# EAGLE design INTERNAL_VCC (EAGLE 7.2.0)
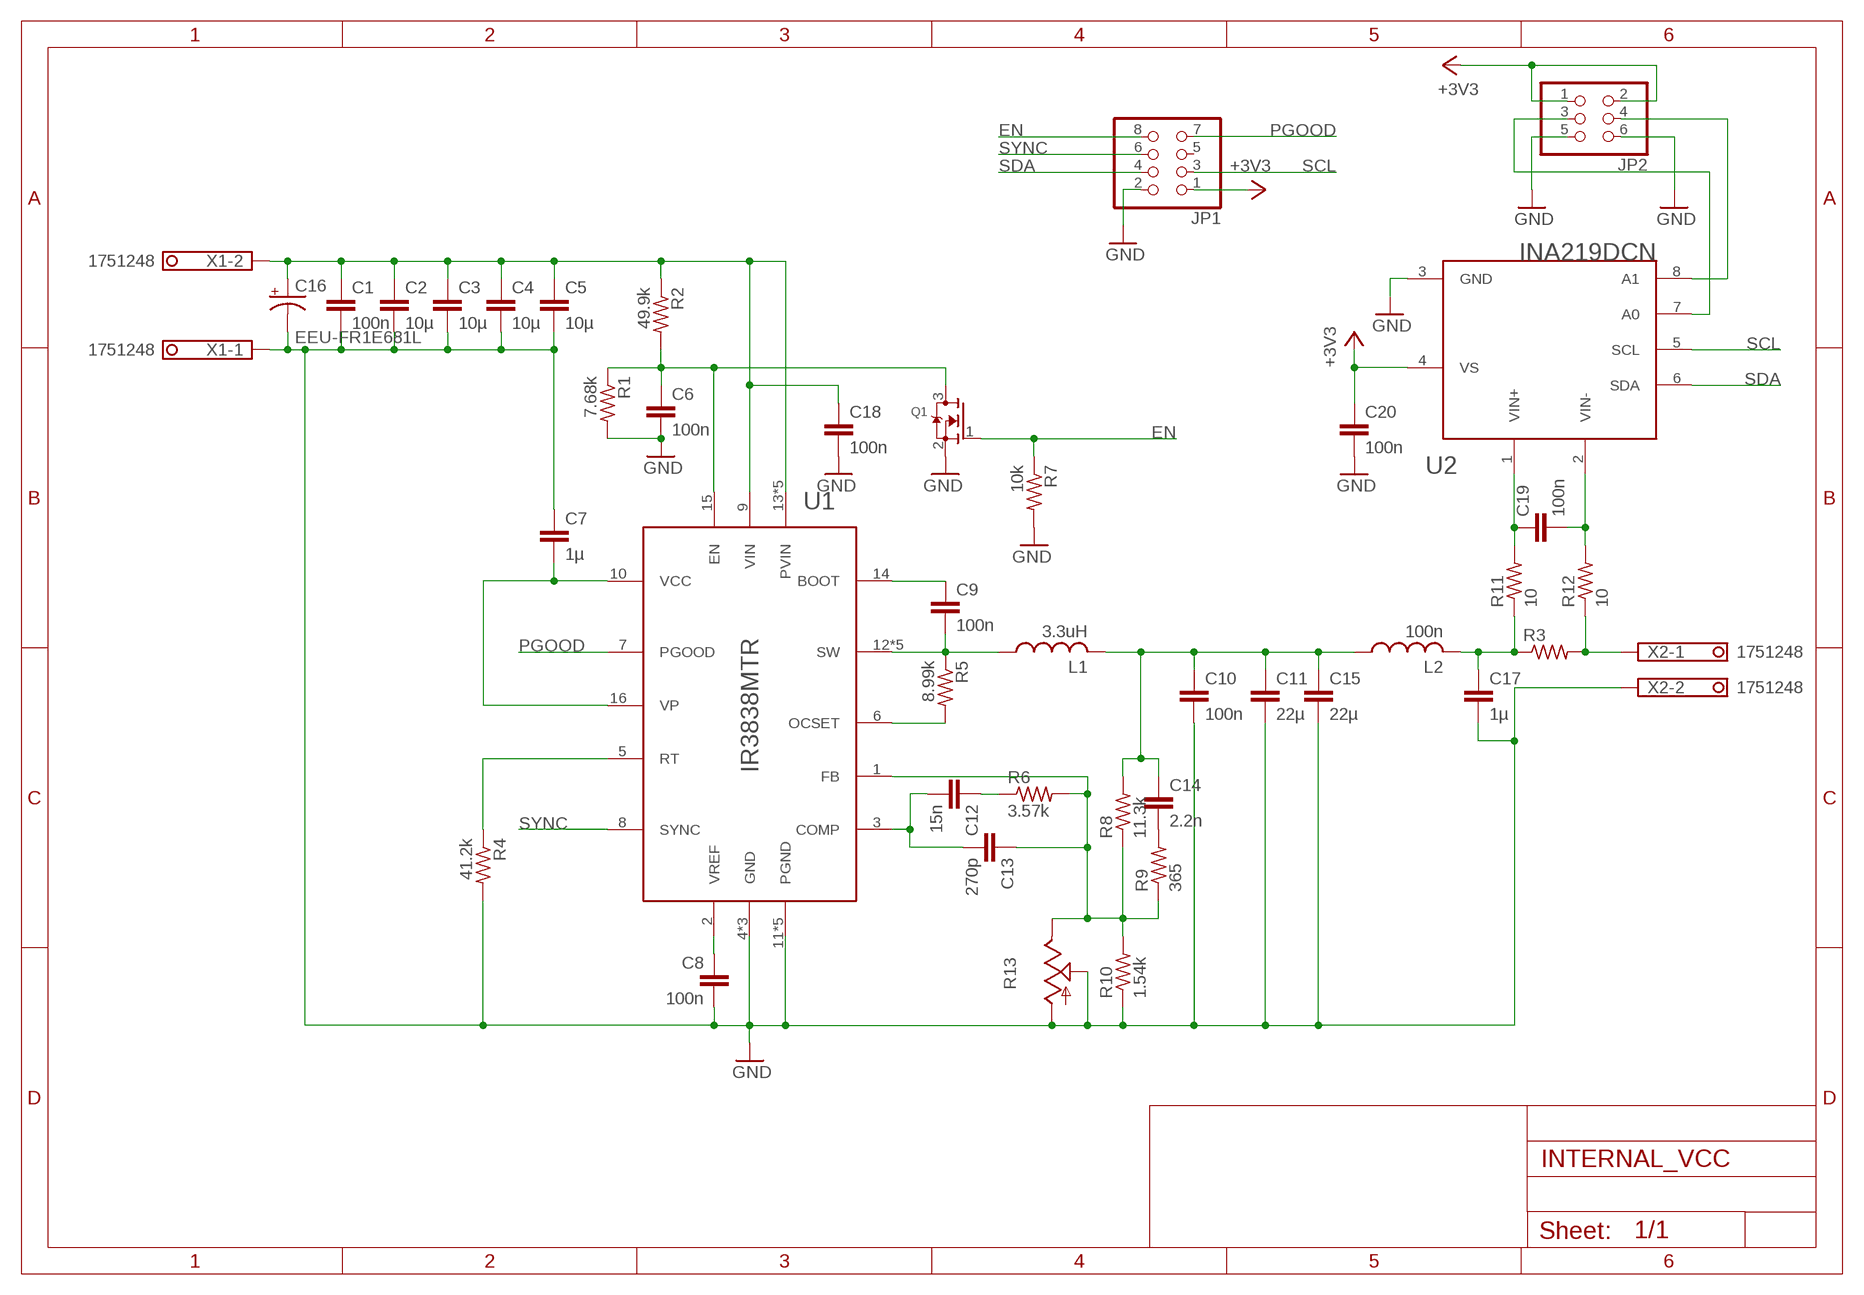
[diagram p0: schematic, sheet 1]

## Parts
C1  100n  C-EUC0603  [C0603]
C2  10µ  C-EUC1206  [C1206]
C3  10µ  C-EUC1206  [C1206]
C4  10µ  C-EUC1206  [C1206]
C5  10µ  C-EUC1206  [C1206]
C6  100n  C-EUC0603  [C0603]
C7  1µ  C-EUC0603  [C0603]
C8  100n  C-EUC0603  [C0603]
C9  100n  C-EUC0603  [C0603]
C10  100n  C-EUC0603  [C0603]
C11  22µ  C-EUC1210  [C1210]
C12  15n  C-EUC0603  [C0603]
C13  270p  C-EUC0603  [C0603]
C14  2.2n  C-EUC0603  [C0603]
C15  22µ  C-EUC1210  [C1210]
C16  EEU-FR1E681L  CPOL-USE3.5-8  [E3,5-8]
C17  1µ  C-EUC0603  [C0603]
C18  100n  C-EUC0603  [C0603]
C19  100n  C-EUC0603  [C0603]
C20  100n  C-EUC0603  [C0603]
JP1  PINHD-2X4/90  [2X04/90]
JP2  PINHD-2X3  [2X03]
L1  3.3uH  L-USXAL7070  [XAL7070]
L2  100n  L-USSRP5030CA  [SRP5030CA]
Q1  MOSFET-NREFLOW  [SOT23]
R1  7.68k  R-US_R0603  [R0603]
R2  49.9k  R-US_R0603  [R0603]
R3  R-US_R2010  [R2010]
R4  41.2k  R-US_R0603  [R0603]
R5  8.99k  R-US_R0603  [R0603]
R6  3.57k  R-US_R0603  [R0603]
R7  10k  R-US_R0603  [R0603]
R8  11.3k  R-US_R0603  [R0603]
R9  365  R-US_R0603  [R0603]
R10  1.54k  R-US_R0603  [R0603]
R11  10  R-US_R0603  [R0603]
R12  10  R-US_R0603  [R0603]
R13  TRIM_US-B25P  [B25P]
U1  IR3838MTR  [PQFN_5X6_MM]
U2  INA219DCN  [DCN-R-PDSO-G8]
X1  1751248  [1751248]
X2  1751248  [1751248]

## Nets
+3V3: C20.1 JP1.1 JP2.1 JP2.2 U2.4(VS)
EN: JP1.8 Q1.1(G) R7.1
GND: C1.2 C2.2 C3.2 C4.2 C5.2 C6.2 C7.1 C8.2 C10.2 C11.2 C15.2 C16.- C17.2 C18.2 C20.2 JP1.2 JP2.5 JP2.6 Q1.2(S) R1.2 R4.2 R7.2 R10.1 R13.A R13.S U1.4(GND) U1.11(PGND) U1.11@1(PGND) U1.11@2(PGND) U1.11@3(PGND) U1.11@4(PGND) U1.P$1(GND) U1.P$26(GND) U2.3(GND) X1.1 X2.2
N$1: C1.1 C2.1 C3.1 C4.1 C5.1 C16.+ C18.1 R2.1 U1.9(VIN) U1.13(PVIN) U1.13@1(PVIN) U1.13@2(PVIN) U1.13@3(PVIN) U1.13@4(PVIN) X1.2
N$2: C17.1 L2.2 R3.1 R11.1
N$3: C7.2 U1.10(VCC) U1.16(VP)
N$4: R3.2 R12.1 X2.1
N$5: C6.1 Q1.3(D) R1.1 R2.2 U1.15(EN)
N$6: C8.1 U1.2(VREF)
N$7: R4.1 U1.5(RT)
N$8: C9.2 L1.1 L1.3 R5.1 U1.12(SW) U1.12@1(SW) U1.12@2(SW) U1.12@3(SW) U1.12@4(SW)
N$9: C9.1 U1.14(BOOT)
N$10: R5.2 U1.6(OCSET)
N$11: C19.1 R11.2 U2.1(VIN+)
N$12: C12.2 C13.2 U1.3(COMP)
N$13: C12.1 R6.1
N$14: C19.2 R12.2 U2.2(VIN-)
N$15: C13.1 R6.2 R8.1 R9.1 R10.2 R13.E U1.1(FB)
N$16: C14.2 R9.2
N$17: C10.1 C11.1 C14.1 C15.1 L1.2 L1.4 L2.1 R8.2
N$18: JP2.4 U2.8(A1)
N$19: JP2.3 U2.7(A0)
PGOOD: JP1.7 U1.7(PGOOD)
SCL: JP1.3 U2.5(SCL)
SDA: JP1.4 U2.6(SDA)
SYNC: JP1.6 U1.8(SYNC)
Unconnected: JP1.5

## Library data of the parts
C1-C15 C17-C20 = rcl:C-EU: CAPACITOR, European symbol
C16 = rcl:CPOL-US: POLARIZED CAPACITOR, American symbol
JP1 = pinhead:PINHD-2X4: PIN HEADER
JP2 = pinhead:PINHD-2X3: PIN HEADER
L1 L2 = inductors:L-US: INDUCTOR, American symbol
Q1 = adafruit:MOSFET-N: N-Channel Mosfet 2N7002E - 60V 260mA SOT23 [Digikey: 2N7002ET1GOSTR-ND] - REEL BSH103 - 30V 850mA SOT23 [Digikey: 568-5013-1-ND]
R1-R12 = rcl:R-US_: RESISTOR, American symbol
R13 = pot:TRIM_US-: POTENTIOMETER
U1 = IR3838M:IR3838M
U2 = texas-1:INA219
X1 X2 = con-phoenix-350:1751248: MKDS 1/ 2-3,5 Printklemme Nennstrom: 10 A Bemessungsspannung: 160 V Raster: 3,5 mm Polzahl: 2 Montageart: Löten Anschlussart: Schraubanschluss Anschlussrichtung vom Leiter zur Platine: 0° Source: http://eshop.phoenixcontact.com .. 1751248.pdf; OC_FARNELL: unknown; OC_NEWARK: unknown

## Board
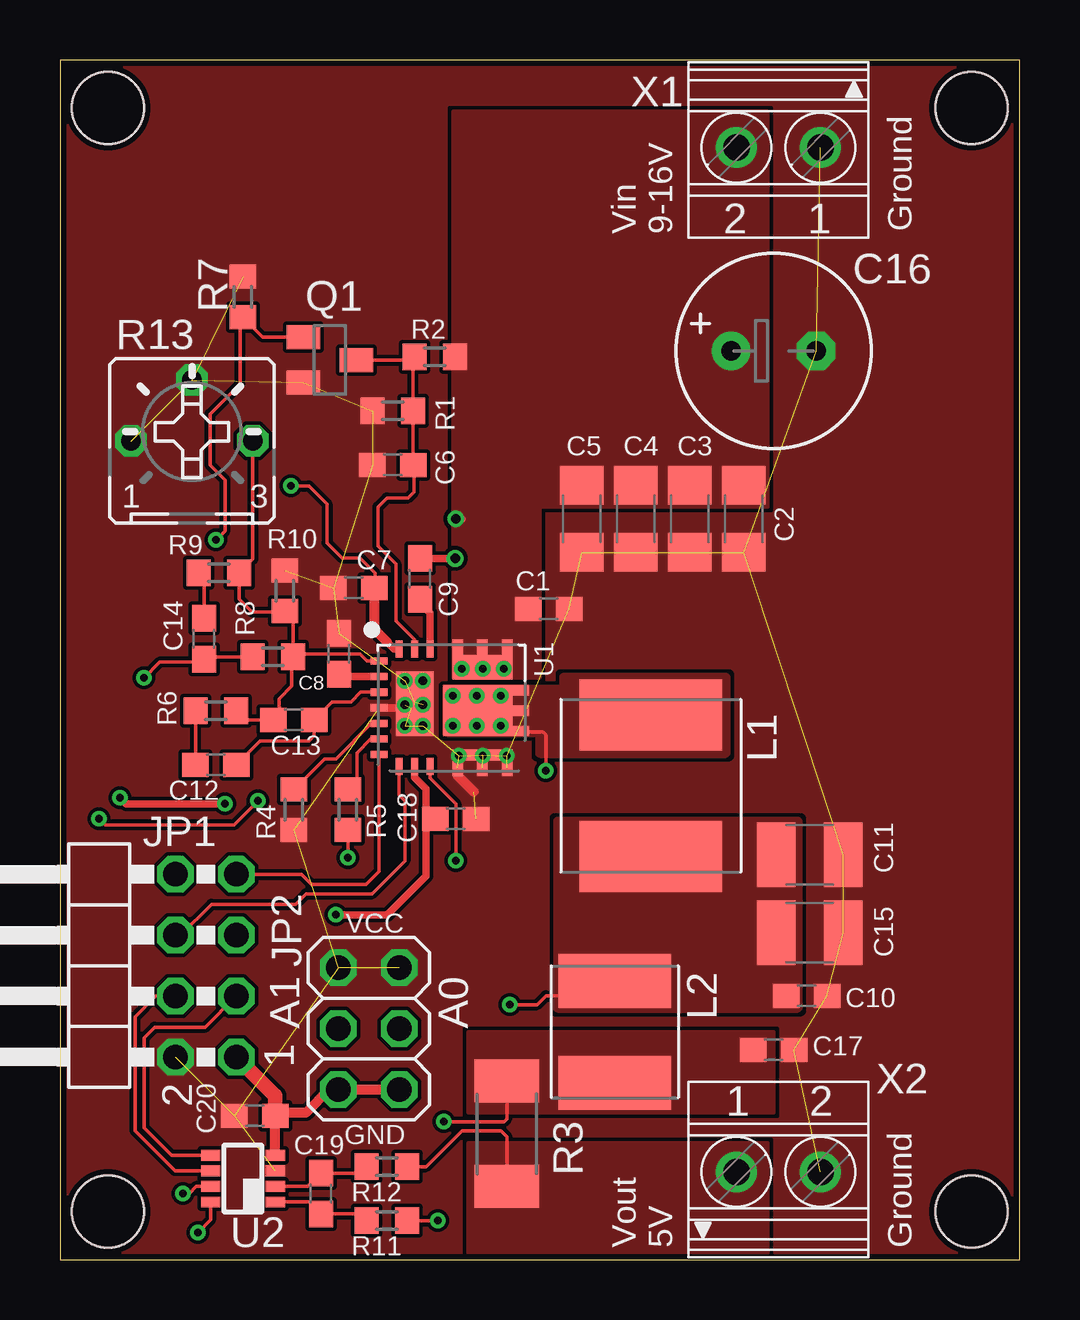
[diagram p1: board, top side]
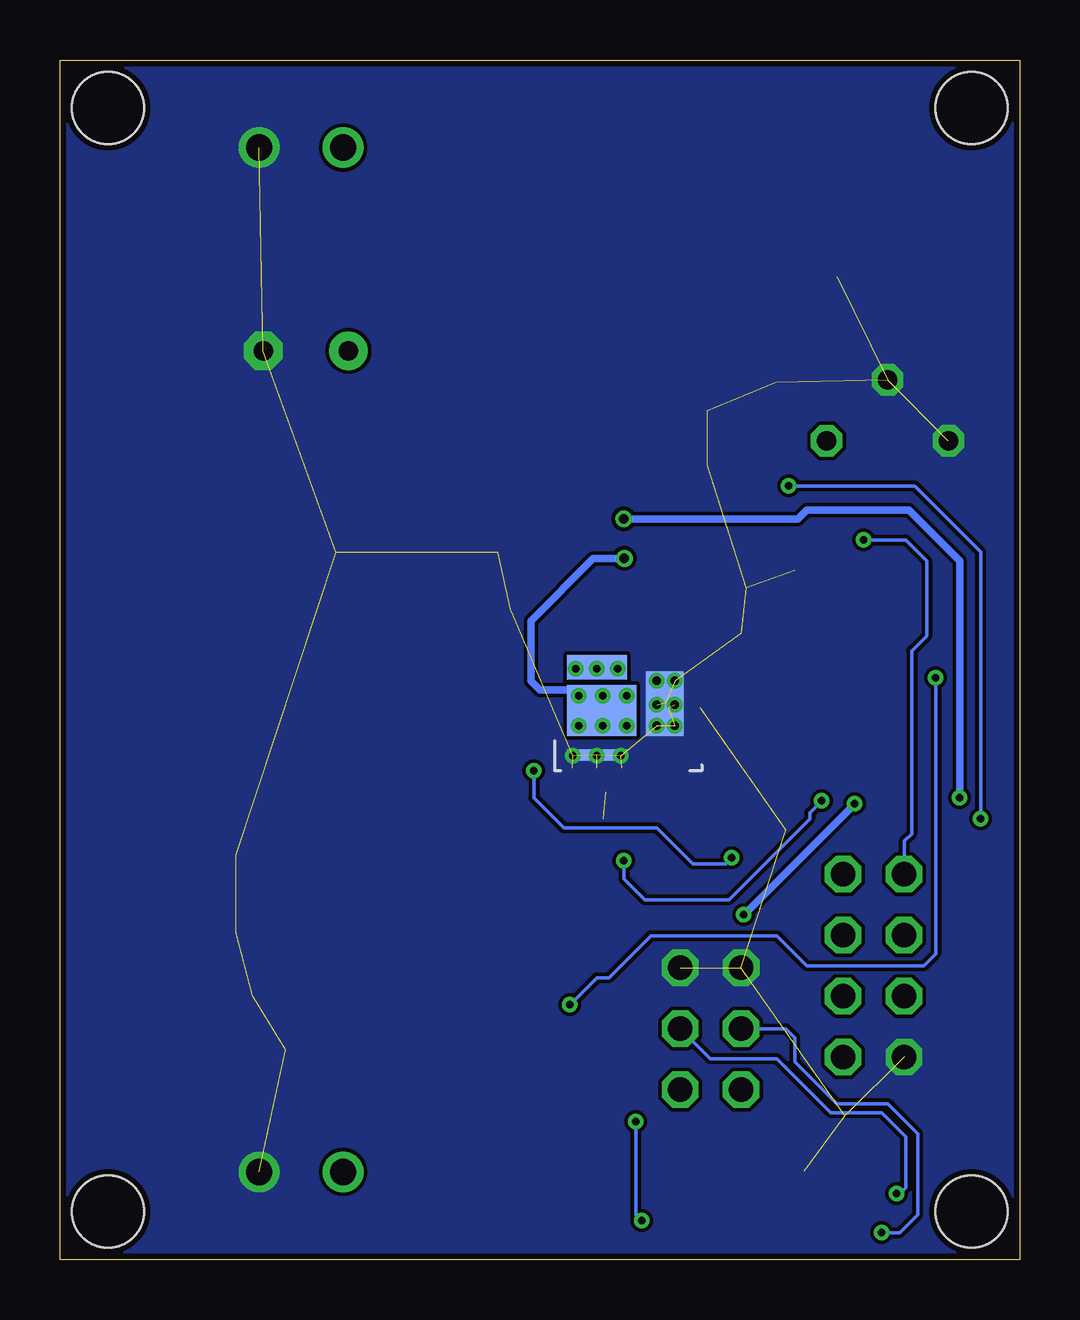
[diagram p2: board, bottom side, seen from below]

Size 40 x 50 mm. Coordinates in mm from the lower left corner, seen from the top.
Outline: 0,0 40,0 40,50 0,50 0,0
Copper layers (1*16): Top 0.035mm / dielectric 1.5mm / Bottom 0.035mm
Design rules "ITEADstudio_DRC": minimum track width 6mil, minimum drill 12mil, track to track 6mil, track to pad 6mil, pad to pad 6mil, via to via 6mil, smd to smd 0mil, copper to edge 10mil, drill to drill 10mil, minimum pad ring 10mil, minimum via ring 6mil, stop-mask expansion 2mil, vias tented up to drill 100mil, thermal gap 10mil
Holes 3 mm at 38,2 2,2 2,48 38,48

### Footprints (pad centres in the part's own frame; a part is rotated, then mirrored left to right if it is on the bottom)
C0603 = smd 1.1 x 1: 1 -0.85,0; 2 0.85,0
C1206 = smd 1.6 x 1.8: 1 -1.4,0; 2 1.4,0
C1210 = smd 1.6 x 2.7: 1 -1.4,0; 2 1.4,0
E3,5-8 = drill 0.813 pad 1.6: + -1.778,0 | drill 0.813 pad 1.6 octagon: - 1.778,0
2X04/90 = drill 1.016 octagon: 1 -3.81,-6.35; 2 -3.81,-3.81; 3 -1.27,-6.35; 4 -1.27,-3.81; 5 1.27,-6.35; 6 1.27,-3.81; 7 3.81,-6.35; 8 3.81,-3.81
2X03 = drill 1.016 octagon: 1 -2.54,-1.27; 2 -2.54,1.27; 3 0,-1.27; 4 0,1.27; 5 2.54,-1.27; 6 2.54,1.27
XAL7070 = smd 1.63 x 5.93: 1 -2.285,0; 2 2.285,0 | smd 2 x 5.93: 3 -3.428,0; 4 3.428,0
SRP5030CA = smd 2.25 x 4.7: 1 -2.125,0; 2 2.125,0
SOT23 = smd 1 x 1.4: 1 -0.95,-1.1; 2 0.95,-1.1; 3 0,1.1
R0603 = smd 1 x 1.1: 1 -0.85,0; 2 0.85,0
R2010 = smd 1.8 x 2.7: 1 -2.2,0; 2 2.2,0
B25P = drill 0.813 octagon: A -2.54,0; E 2.54,0; S 0,2.54
PQFN_5X6_MM = smd 0.3 x 0.7: 1 -1.95,-2.45; 2 -1.3,-2.45; 3 -0.65,-2.45; 4 0,-2.45; 5 0.65,-2.45; 6 1.3,-2.45; 7 1.95,-2.45 | smd 0.7 x 0.3: 8 2.45,-1.62; 9 2.45,-0.97; 10 2.45,-0.32; 14 -2.45,-0.32; 15 -2.45,-0.97; 16 -2.45,-1.62 | smd 0.7 x 0.43: 11 2.5,0.83; 11@1 2.5,1.86; 11@2 2.5,2.89; 13 -2.5,2.89; 13@1 -2.5,1.86; 13@2 -2.5,0.83 | smd 0.45 x 2.49: 11@3 1.97,1.86 | smd 0.45 x 2.49 bottom: 11@4 1.97,1.86 | smd 0.43 x 0.7: 12 0.97,3.46; 12@1 0.12,3.46; 12@2 -0.73,3.46 | smd 2.13 x 2.89: 12@3 0.12,1.66 | smd 2.13 x 2.89 bottom: 12@4 0.12,1.66 | smd 1.02 x 2.49: 13@3 -1.69,1.86 | smd 1.02 x 2.49 bottom: 13@4 -1.69,1.86 | smd 2.69 x 1.55 bottom: P$1 -0.16,-0.96 | smd 2.69 x 1.55: P$26 -0.16,-0.96
DCN-R-PDSO-G8 = smd 0.45 x 0.8: 1 -0.975,-1.35; 2 -0.325,-1.35; 3 0.325,-1.35; 4 0.975,-1.35; 5 0.975,1.35; 6 0.325,1.35; 7 -0.325,1.35; 8 -0.975,1.35
1751248 = drill 1.1 pad 1.7: 1 -1.75,-0.1; 2 1.75,-0.1

### Placement (x,y rotation side)
C1  20.38,27.12 0 top
C2  28.5,30.88 270 top
C3  26.25,30.88 270 top
C4  24,30.88 270 top
C5  21.75,30.88 270 top
C6  13.88,33.12 180 top
C7  12.25,28 0 top
C8  11.62,25.25 90 top
C9  15,28.38 90 top
C10  31.12,11 0 top
C11  31.25,16.88 0 top
C12  6.5,20.62 0 top
C13  9.75,22.5 0 top
C14  6,25.88 90 top
C15  31.25,13.62 0 top
C16  29.75,37.88 0 top
C17  29.75,8.75 0 top
C18  16.5,18.38 0 top
C19  10.88,2.75 90 top
C20  8.12,6 180 top
JP1  1,12.25 90 top
JP2  12.88,9.62 90 top
L1  24.62,19.75 270 top
L2  23.12,9.5 270 top
Q1  11.25,37.5 270 top
R1  13.88,35.38 180 top
R2  15.62,37.62 180 top
R3  18.62,5.25 270 top
R4  9.75,18.75 270 top
R5  12,18.75 90 top
R6  6.5,22.88 0 top
R7  7.62,40.12 90 top
R8  8.88,25.12 180 top
R9  6.62,28.62 180 top
R10  9.38,27.88 270 top
R11  13.62,1.62 180 top
R12  13.62,3.88 180 top
R13  5.5,34.12 0 top
U1  15.75,23 270 top
U2  7.62,3.38 90 top
X1  29.95,46.25 180 top
X2  29.95,3.75 0 top

### Tracks (layer width: path | path; a pad name or v marks a point on that pad's centre or on a via)
+3V3
  Top 0.406: U2.4 C20.1 9.1,6.12 10.25,6.12 11.21,7.08 JP2.2 JP2.1
  Top 0.61: C20.1 8.97,6.83 8.96,6.83 JP1.1
EN  (via drill 0.33)
  Top 0.152: v6.5,30 6.88,30.38 6.88,32.5 6.25,33.12 6.25,35.25 7.5,36.5 7.5,39.15 R7.1 8.45,38.45 Q1.1
  Bottom 0.152: v6.5,30 4.75,30 3.88,29.12 3.88,26 4.5,25.38 4.5,17.75 4.81,17.44 JP1.8
GND  (via drill 0.33, 0.36)  (42 unrouted)
  Top 0.305: U1.4 14.63,23 U1.P$1
  Top 0.406: U1.11 16.58,20.17 17.25,19.5
  Top 0.61: U1.P$1 14.79,23.21 14.75,23.25
  Bottom 0.406: v14.38,24.12 v15.12,24.12
  other vias: 14.38,22.25 14.38,23.12 15.12,22.25 15.12,23.12 16.62,21 17.62,21 18.62,21
  pour Bottom (rank 6, no thermals): 0,50 40,50 40,0 0,0
  pour Top (rank 6, no thermals): 40,50 0,50 0,0 40,0
N$1  (via drill 0.33, 0.4)  (1 unrouted)
  Top 0.305: U1.9 14.78,20.09 15.25,19.62 15.25,18.77 C18.1 15.25,17.98 15.25,16 14,14.75 13.88,14.62 13.62,14.38 v11.5,14.38 | v16.5,30.88 16.75,30.88 | v6.88,19 2.75,19 v2.5,19.25
  Top 0.406: v17.62,24.62 17.61,24.64 U1.13@4 18.43,24.69 v18.5,24.62
  Bottom 0.305: v2.5,19.25 2.5,29.12 4.62,31.25 8.88,31.25 9.25,30.88 v16.5,30.88 | v11.5,14.38 v6.88,19
  other vias: 16.75,24.62
  pour Top (no thermals): 16.38,24.25 20,24.25 20,31.38 29.5,31.38 29.5,47.88 16.38,47.88
N$2  (via drill 0.33)
  Top 0.152: R11.1 v15.75,1.62 | v16,5.75 18.5,5.75 18.62,5.88 18.62,6.75
  Bottom 0.152: v15.75,1.62 16,1.88 v16,5.75
  pour Top (no thermals): 17,6.12 29.75,6.12 29.75,9.5 17,9.5
N$3  (via drill 0.33)
  Top 0.152: 13.12,27.48 13.1,27.5 | U1.10 15.43,20.07 16.5,19 v16.5,16.62 | v9.62,32.25 10.38,32.25 11.12,31.5 11.12,29.88 11.75,29.25 12.5,29.25 13.12,28.62 13.12,28.02 C7.2 | v1.62,18.38 1.88,18.12 7.25,18.12 v8.25,19.12
  Top 0.305: U1.16 13.93,25.45 13.62,25.75
  Top 0.406: C7.2 13.1,27.5 13.1,26.27 13.62,25.75
  Bottom 0.152: v9.62,32.25 4.38,32.25 1.62,29.5 v1.62,18.38 | v16.5,16.62 16.5,15.88 15.62,15 12.12,15 8.75,18.38 8.75,18.62 v8.25,19.12
N$4
  Top 0.152: R12.1 15.25,3.88 16.75,5.38 18.38,5.38 18.62,5.12 18.62,3.12 18.5,3 18.62,3
  pour Top (no thermals): 17,0 29.5,0 29.5,4.88 17,4.88
N$5
  Top 0.152: U1.15 14.78,25.84 14.44,26.19 14.25,26.38 14,26.62 14,29 13.25,29.75 13.25,31.38 13.62,31.75 14.5,31.75 14.75,32 14.75,33.1 C6.1 R1.1 14.72,37.58 R2.2 14.65,37.5 Q1.3
N$6
  Top 0.305: U1.2 11.72,24.3 C8.1
N$7
  Top 0.152: R4.1 11.03,20.88 11.5,20.88 12.97,22.35 U1.5
N$8  (via drill 0.33, 0.4)
  Top 0.152: v20.25,20.38 20.25,21.88 20.12,22 19.24,22 U1.12 | R5.1 v12,16.75
  Top 0.305: C9.2 v16.48,29.23
  Bottom 0.152: v20.25,20.38 20.25,19.25 19,18 15.12,18 13.62,16.5 12.25,16.5 v12,16.75
  Bottom 0.305: v16.48,29.23 17.77,29.23 20.38,26.62 20.38,24.12 20,23.75 18.62,23.75 v18.38,23.5
  Bottom 0.406: U1.12@4 17.41,23.46 v17.38,23.5 v16.38,23.5
  other vias: 16.38,22.25 17.38,22.25 18.38,22.25
  pour Top (no thermals): 21,23.75 16.12,23.75 16.12,22 20,22 20,21.12 27.75,21.12 27.75,24.25 21,24.25
N$9
  Top 0.305: U1.14 15.43,26.95 15,27.38 C9.1 14.88,27.4
N$10
  Top 0.152: U1.6 12.95,21.7 12.38,21.12 12.38,19.98 R5.2 11.75,19.38
N$11
  Top 0.152: R11.2 12.5,1.9 C19.1 10.38,2.4 U2.1
N$12
  Top 0.152: C13.2 10.6,21.85 10.38,21.62 8.35,21.62 C12.2 | C13.2 10.75,22.5 | U1.3 12.53,23.65 12.12,23.25 11.35,23.25 C13.2
N$13
  Top 0.152: C12.1 R6.1
N$14
  Top 0.152: R12.2 12.5,3.6 C19.2 10.32,3.05 U2.2
N$15
  Top 0.152: U1.1 12.8,24.95 12.5,25.25 9.85,25.25 R8.1 | R8.1 9.65,25.05 9.65,23.9 9.12,23.38 9.12,23.02 9.28,22.88 C13.1 7.72,22.5 R6.2 | R8.1 9.72,26.68 R10.2 9.35,27 8,27 7.47,27.52 R9.1 8.04,29.19 R13.E
N$16
  Top 0.152: C14.2 6,28.4 R9.2
N$17  (via drill 0.33)
  Top 0.152: R8.2 6.1,25.12 C14.1 5.9,25.02 5.9,24.9 4.15,24.9 v3.5,24.25 | 22.82,10.88 L2.1 | 21.12,11 20.25,11 19.88,10.62 v18.75,10.62
  Bottom 0.152: v3.5,24.25 3.5,12.75 4,12.25 8.88,12.25 10.12,13.5 15.38,13.5 17.12,11.75 17.62,11.75 v18.75,10.62
  pour Top (no thermals): 20.75,18.25 20.75,10.5 30.75,10.5 30.75,18.25
N$18  (via drill 0.33)
  Top 0.152: U2.8 6.28,1.65 v5.75,1.12
  Bottom 0.152: v5.75,1.12 5,1.12 4.25,1.88 4.25,5.25 5.5,6.5 7.62,6.5 9.38,8.25 9.38,9.25 9.75,9.62 JP2.4
N$19  (via drill 0.33)
  Top 0.152: U2.7 5.67,3.05 5.38,2.75 v5.12,2.75
  Bottom 0.152: v5.12,2.75 5,2.75 4.75,3 4.75,5.12 5.75,6.12 7.88,6.12 10.12,8.38 12.89,8.38 JP2.3
PGOOD
  Top 0.152: U1.7 13.3,16.18 12.77,15.64 10.48,15.64 10.06,16.06 JP1.7
SCL
  Top 0.152: U2.5 4.65,4.35 3.5,5.5 3.5,9.25 3.94,9.69 6.06,9.69 JP1.3
SDA
  Top 0.152: U2.6 4.8,3.7 3.12,5.38 3.12,10.12 3.98,10.98 JP1.4
SYNC
  Top 0.152: U1.8 14.13,19.37 14.38,19.12 14.38,16.62 13,15.25 10.25,15.25 9.81,14.81 6.31,14.81 5.02,13.52 JP1.6

### Text on the board
tPlace: Vin / 9-16V | Ground | VCC | A1 | A0 | 1 | 2 | GND | Vout / 5V | Ground